# EAGLE design Daughter Board V3_ (EAGLE 9.6.2)
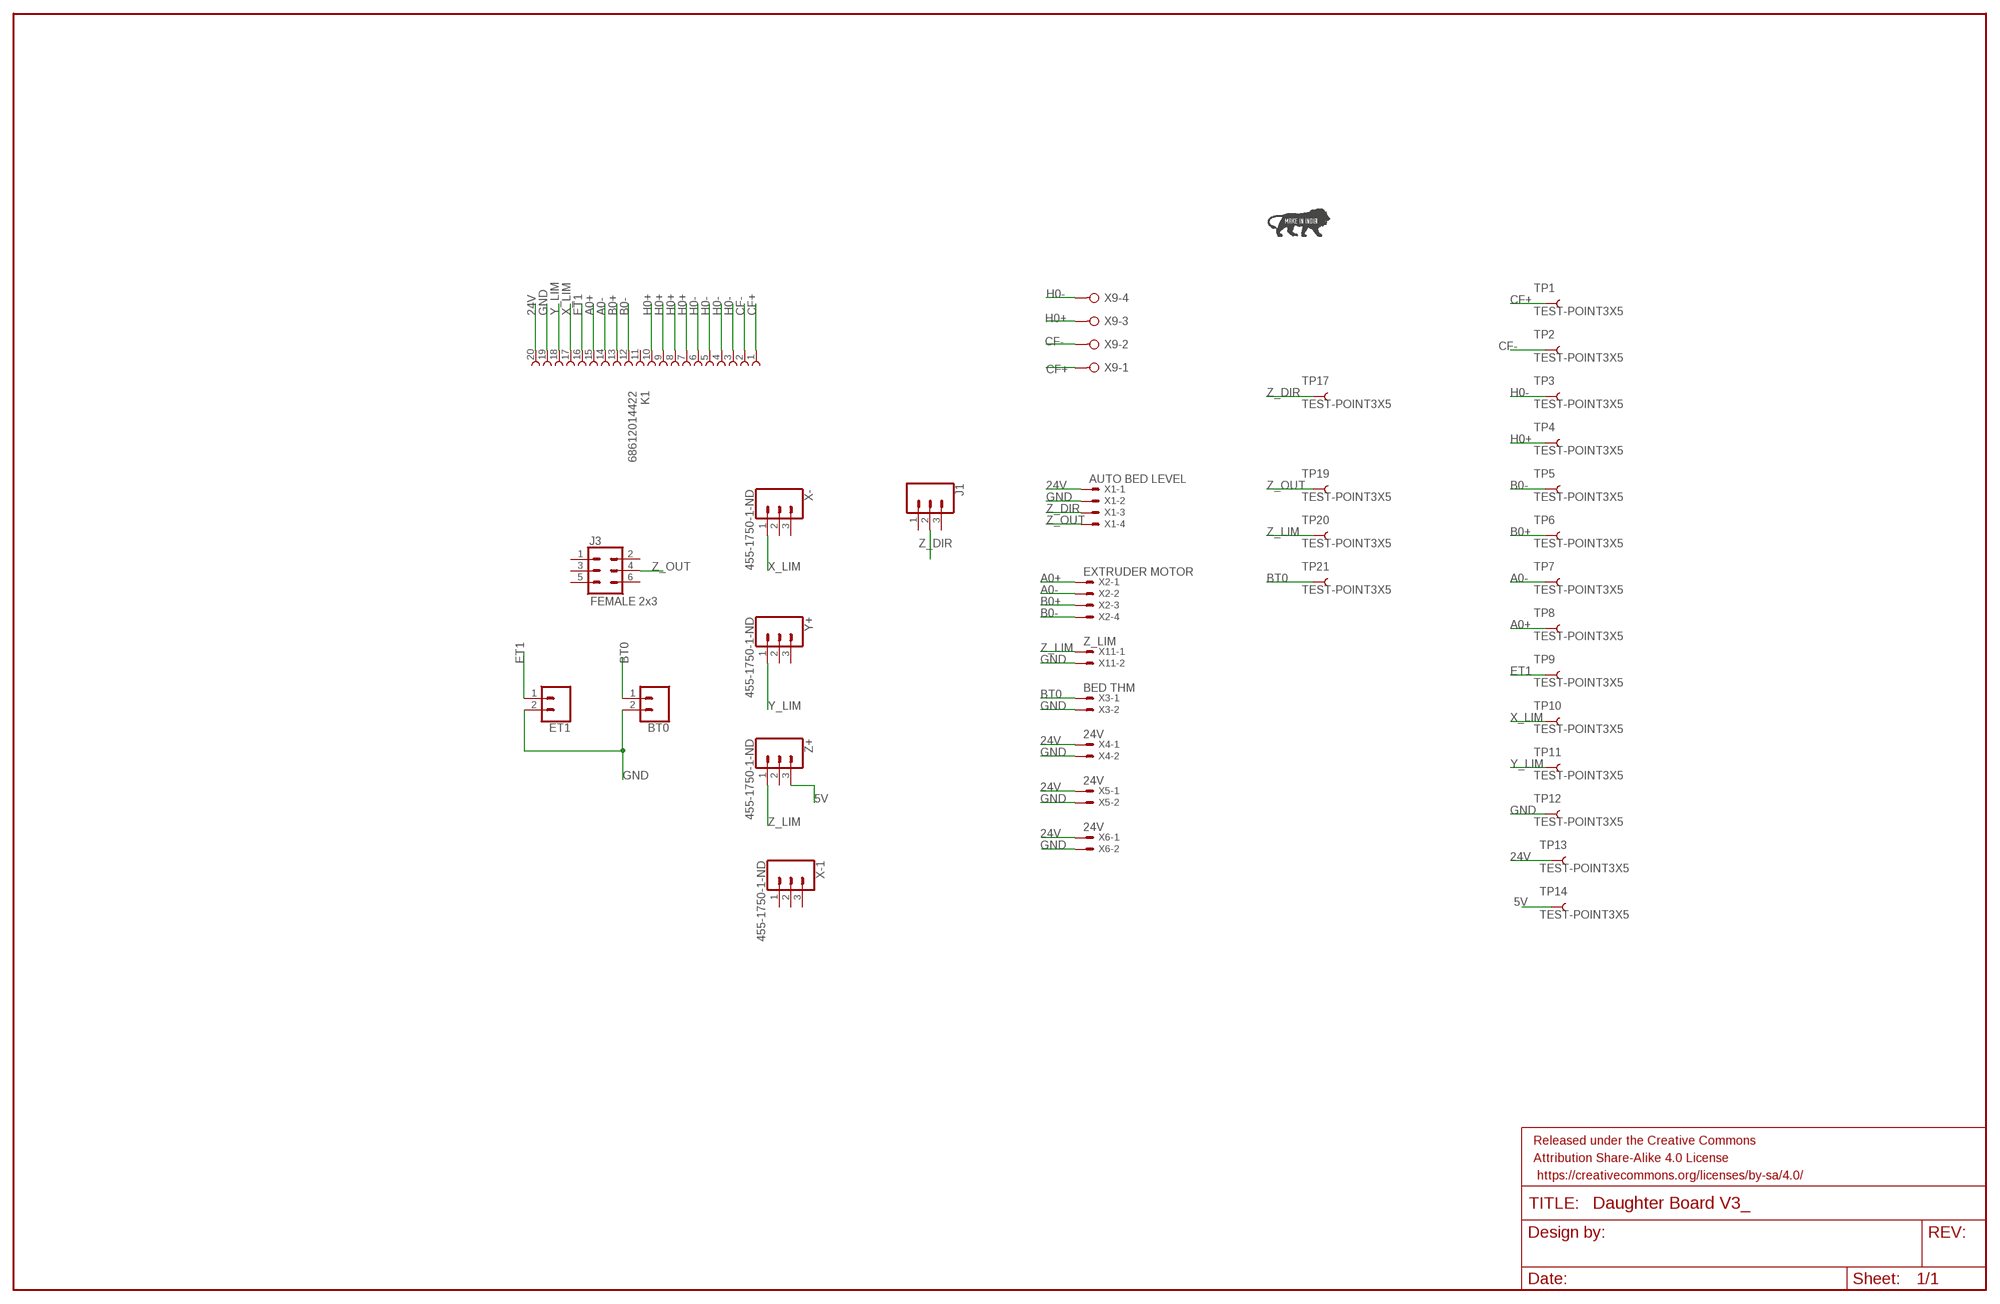
[diagram p0: schematic, sheet 1]

## Parts
BT0  CONN_02  [1X02]
ET1  CONN_02  [1X02]
FRAME1  FRAME-LEDGER  [CREATIVE_COMMONS]
J1  455-1750-1-ND  CONN_03  [1X03]
J3  FEMALE 2x3  CONN_03X2FEMALE  [2X3]
K1  68612014422  [68612014422]
TP1  TEST-POINT3X5  [PAD.03X.05]
TP2  TEST-POINT3X5  [PAD.03X.05]
TP3  TEST-POINT3X5  [PAD.03X.05]
TP4  TEST-POINT3X5  [PAD.03X.05]
TP5  TEST-POINT3X5  [PAD.03X.05]
TP6  TEST-POINT3X5  [PAD.03X.05]
TP7  TEST-POINT3X5  [PAD.03X.05]
TP8  TEST-POINT3X5  [PAD.03X.05]
TP9  TEST-POINT3X5  [PAD.03X.05]
TP10  TEST-POINT3X5  [PAD.03X.05]
TP11  TEST-POINT3X5  [PAD.03X.05]
TP12  TEST-POINT3X5  [PAD.03X.05]
TP13  TEST-POINT3X5  [PAD.03X.05]
TP14  TEST-POINT3X5  [PAD.03X.05]
TP17  TEST-POINT3X5  [PAD.03X.05]
TP19  TEST-POINT3X5  [PAD.03X.05]
TP20  TEST-POINT3X5  [PAD.03X.05]
TP21  TEST-POINT3X5  [PAD.03X.05]
U$2  MAKEININDIA  [MAKEININDIA]
X1  AUTO BED LEVEL  JST-XH-04-PIN-LONG-PAD  [JST-XH-04-PACKAGE-LONG-PAD]
X2  EXTRUDER MOTOR  JST-XH-04-PIN-LONG-PAD  [JST-XH-04-PACKAGE-LONG-PAD]
X3  BED THM  JST-XH-02-PIN-LONG-PAD  [JST-XH-02-PACKAGE-LONG-PAD]
X4  24V  JST-XH-02-PIN-LONG-PAD  [JST-XH-02-PACKAGE-LONG-PAD]
X5  24V  JST-XH-02-PIN-LONG-PAD  [JST-XH-02-PACKAGE-LONG-PAD]
X6  24V  JST-XH-02-PIN-LONG-PAD  [JST-XH-02-PACKAGE-LONG-PAD]
X9  W237-04P  [W237-4P]
X11  Z_LIM  JST-XH-02-PIN-LONG-PAD  [JST-XH-02-PACKAGE-LONG-PAD]
X-  455-1750-1-ND  CONN_03  [1X03]
X-1  455-1750-1-ND  CONN_03  [1X03]
Y+  455-1750-1-ND  CONN_03  [1X03]
Z+  455-1750-1-ND  CONN_03  [1X03]

## Nets
5V: TP14.P$1 Z+.3
24V: K1.20 TP13.P$1 X1.1 X4.1 X5.1 X6.1
A0+: K1.15 TP8.P$1 X2.1
A0-: K1.14 TP7.P$1 X2.2
B0+: K1.13 TP6.P$1 X2.3
B0-: K1.12 TP5.P$1 X2.4
BT0: BT0.1 TP21.P$1 X3.1
CF+: K1.1 TP1.P$1 X9.1
CF-: K1.2 TP2.P$1 X9.2
ET1: ET1.1 K1.16 TP9.P$1
GND: BT0.2 ET1.2 K1.19 TP12.P$1 X1.2 X3.2 X4.2 X5.2 X6.2 X11.2
H0+: K1.7 K1.8 K1.9 K1.10 TP4.P$1 X9.3
H0-: K1.3 K1.4 K1.5 K1.6 TP3.P$1 X9.4
X_LIM: K1.17 TP10.P$1 X-.1
Y_LIM: K1.18 TP11.P$1 Y+.1
Z_DIR: J1.2 TP17.P$1 X1.3
Z_LIM: TP20.P$1 X11.1 Z+.1
Z_OUT: J3.4 TP19.P$1 X1.4
Unconnected: J1.1 J1.3 J3.1 J3.2 J3.3 J3.5 J3.6 K1.11 X-1.1 X-1.2 X-1.3 X-.2 X-.3 Y+.2 Y+.3 Z+.2

## Library data of the parts
BT0 ET1 = SparkFun-Connectors:CONN_02: Multi connection point. Often used as Generic Header-pin footprint for 0.1 inch spaced/style header connections On any of the 0.1 inch spaced packages, you can populate with these: Break Away Headers - Straight <https://www.sparkfun.com/products/116> (PRT-00116) Break Away Male Headers - Right Angle <https://www.sparkfun.com/products/553> (PRT-00553) Female Headers <https://www.sparkfun.com/products/115> (PRT-00115) Break Away Headers - Machine Pin <https://www.sparkfun.com/products/117> (PRT-00117) Break Away Female Headers - Swiss Machine Pin <https://www.sparkfun.com/products/743> (PRT-00743) For SCREWTERMINALS and SPRING TERMINALS visit here: Screw Terimnals on SparkFun.com <https://www.sparkfun.com/search/results?term=Screw+Terminals> (5mm/3.5mm/2.54mm spacing) This device is also useful as a general connection point to wire up your design to another part of your project. Our various solder wires solder well into these plated through hole pads. Hook-Up Wire - Assortment (Stranded, 22 AWG) <https://www.sparkfun.com/products/11375> (PRT-11375) Hook-Up Wire - Assortment (Solid Core, 22 AWG) <https://www.sparkfun.com/products/11367> (PRT-11367) View the entire wire category on our website here <https://www.sparkfun.com/categories/141> Special notes: Molex polarized connector foot print use with: PRT-08233 with associated crimp pins and housings. 2.54_SCREWTERM for use with PRT-10571. 3.5mm Screw Terminal footprints for PRT-08084 5mm Screw Terminal footprints for use with PRT-08432
FRAME1 = SparkFun-Aesthetics:FRAME-LEDGER: Schematic Frame - Ledger Standard 11x14 US Ledger frame
J1 X- X-1 Y+ Z+ = SparkFun-Connectors:CONN_03: Multi connection point. Often used as Generic Header-pin footprint for 0.1 inch spaced/style header connections On any of the 0.1 inch spaced packages, you can populate with these: Break Away Headers - Straight <https://www.sparkfun.com/products/116> (PRT-00116) Break Away Male Headers - Right Angle <https://www.sparkfun.com/products/553> (PRT-00553) Female Headers <https://www.sparkfun.com/products/115> (PRT-00115) Break Away Headers - Machine Pin <https://www.sparkfun.com/products/117> (PRT-00117) Break Away Female Headers - Swiss Machine Pin <https://www.sparkfun.com/products/743> (PRT-00743) Stackable Header - 3 Pin (Female, 0.1") <https://www.sparkfun.com/products/13875> (PRT-13875) For SCREWTERMINALS and SPRING TERMINALS visit here: Screw Terimnals on SparkFun.com <https://www.sparkfun.com/search/results?term=Screw+Terminals> (5mm/3.5mm/2.54mm spacing) This device is also useful as a general connection point to wire up your design to another part of your project. Our various solder wires solder well into these plated through hole pads. Hook-Up Wire - Assortment (Stranded, 22 AWG) <https://www.sparkfun.com/products/11375> (PRT-11375) Hook-Up Wire - Assortment (Solid Core, 22 AWG) <https://www.sparkfun.com/products/11367> (PRT-11367) View the entire wire category on our website here <https://www.sparkfun.com/categories/141> Special notes: Molex polarized connector foot print use with SKU : PRT-08232 with associated crimp pins and housings.; PROD_ID: XXX-00000
J3 = SparkFun-Connectors:CONN_03X2: Multi connection point. Often used as Generic Header-pin footprint for 0.1 inch spaced/style header connections You can populate with any combo of single row headers, but if you'd like an exact match, check these: Header - 2x3 (Male, 0.1") <https://www.sparkfun.com/products/12807> (PRT-12807) Header - 2x3 (Female, 0.1") <https://www.sparkfun.com/products/13010> (PRT-13010) 2x3 Pin Shrouded Header <https://www.sparkfun.com/products/10877> (PRT-10877) On any of the 0.1 inch spaced packages, you can populate with these: Break Away Headers - Straight <https://www.sparkfun.com/products/116> (PRT-00116) Break Away Male Headers - Right Angle <https://www.sparkfun.com/products/553> (PRT-00553) Female Headers <https://www.sparkfun.com/products/115> (PRT-00115) Break Away Headers - Machine Pin <https://www.sparkfun.com/products/117> (PRT-00117) Break Away Female Headers - Swiss Machine Pin <https://www.sparkfun.com/products/743> (PRT-00743) Special note: the shrouded connector mates well with our 3x2 ribbon cables: Ribbon Crimp Connector - 6-pin (2x3, Female) <https://www.sparkfun.com/products/10651> (PRT-10651) Ribbon Cable - 6 wire (15ft) <https://www.sparkfun.com/products/10646> (PRT-10646); PROD_ID: CONN-11566
K1 = Wurth_Elektronik_Electromechanic_FPC_Connectors_&_Flat_Flexible_Cable_rev15b:68612014422: WR-FPC 1.00mm SMT ZIF Horizontal Bottom Contact, 20 Pins=>Code : Con_FPC_ZIF_1.00_68612014422 <http://katalog.we-online.de/media/images/eican/Con_FPC_ZIF_1.00_6861xx14422_pf2.jpg> Details see: http://katalog.we-online.de/en/em/686_1xx_144_22 Created 2014-07-09, Karrer Zheng 2014 (C) Würth Elektronik
TP1-TP14 TP17 TP19-TP21 = SparkFun-Connectors:TEST-POINT: SparkFun Test Points Bare copper test points for troubleshooting or In-Circuit-Testing. These are used by our Production team for verifying production board runs using pogo-pins on test beds. SparkFun Products: SparkFun LSM9DS1 Breakout <https://www.sparkfun.com/products/13284> SparkFun PSOC <https://www.sparkfun.com/products/13714> SparkFun Load Cell Amplifier <https://www.sparkfun.com/products/13879>
U$2 = FracktalWorks_Eagle_Library:MAKEININDIA
X1 X2 = Rembrandt Electronics - JST XH Connectors v1-0:JST-XH-04-PIN: JST XH Connector 2 Pin Wire to board connector. Pitch: 2,54 mm, (0.100") Number of pins: 4 Created by Rembrandt Electronics www.rembrandtelectronics.com
X3-X6 X11 = Rembrandt Electronics - JST XH Connectors v1-0:JST-XH-02-PIN: JST XH Connector 2 Pin Wire to board connector. Pitch: 2,54 mm, (0.100") Number of pins: 2 Created by Rembrandt Electronics www.rembrandtelectronics.com
X9 = con-wago-508:W237-04P: WAGO SREW CLAMP; OC_FARNELL: unknown; OC_NEWARK: unknown

## Net classes
0 default: width 0.406 mm

## Board
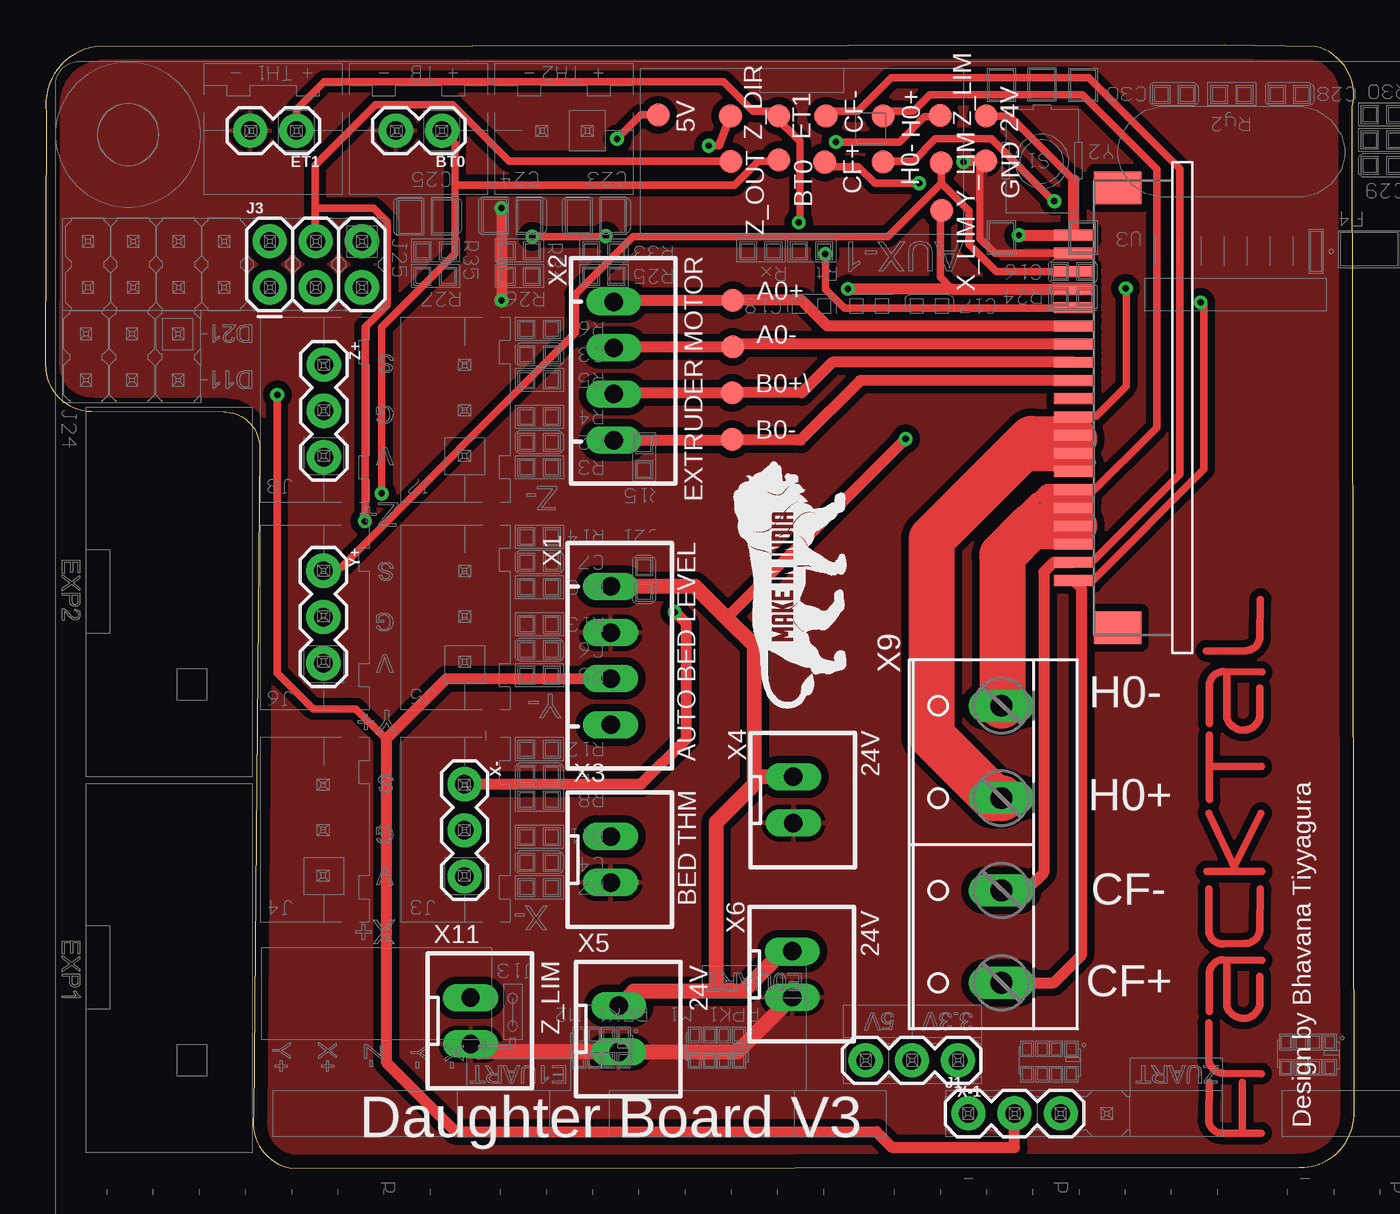
[diagram p1: board, top side]
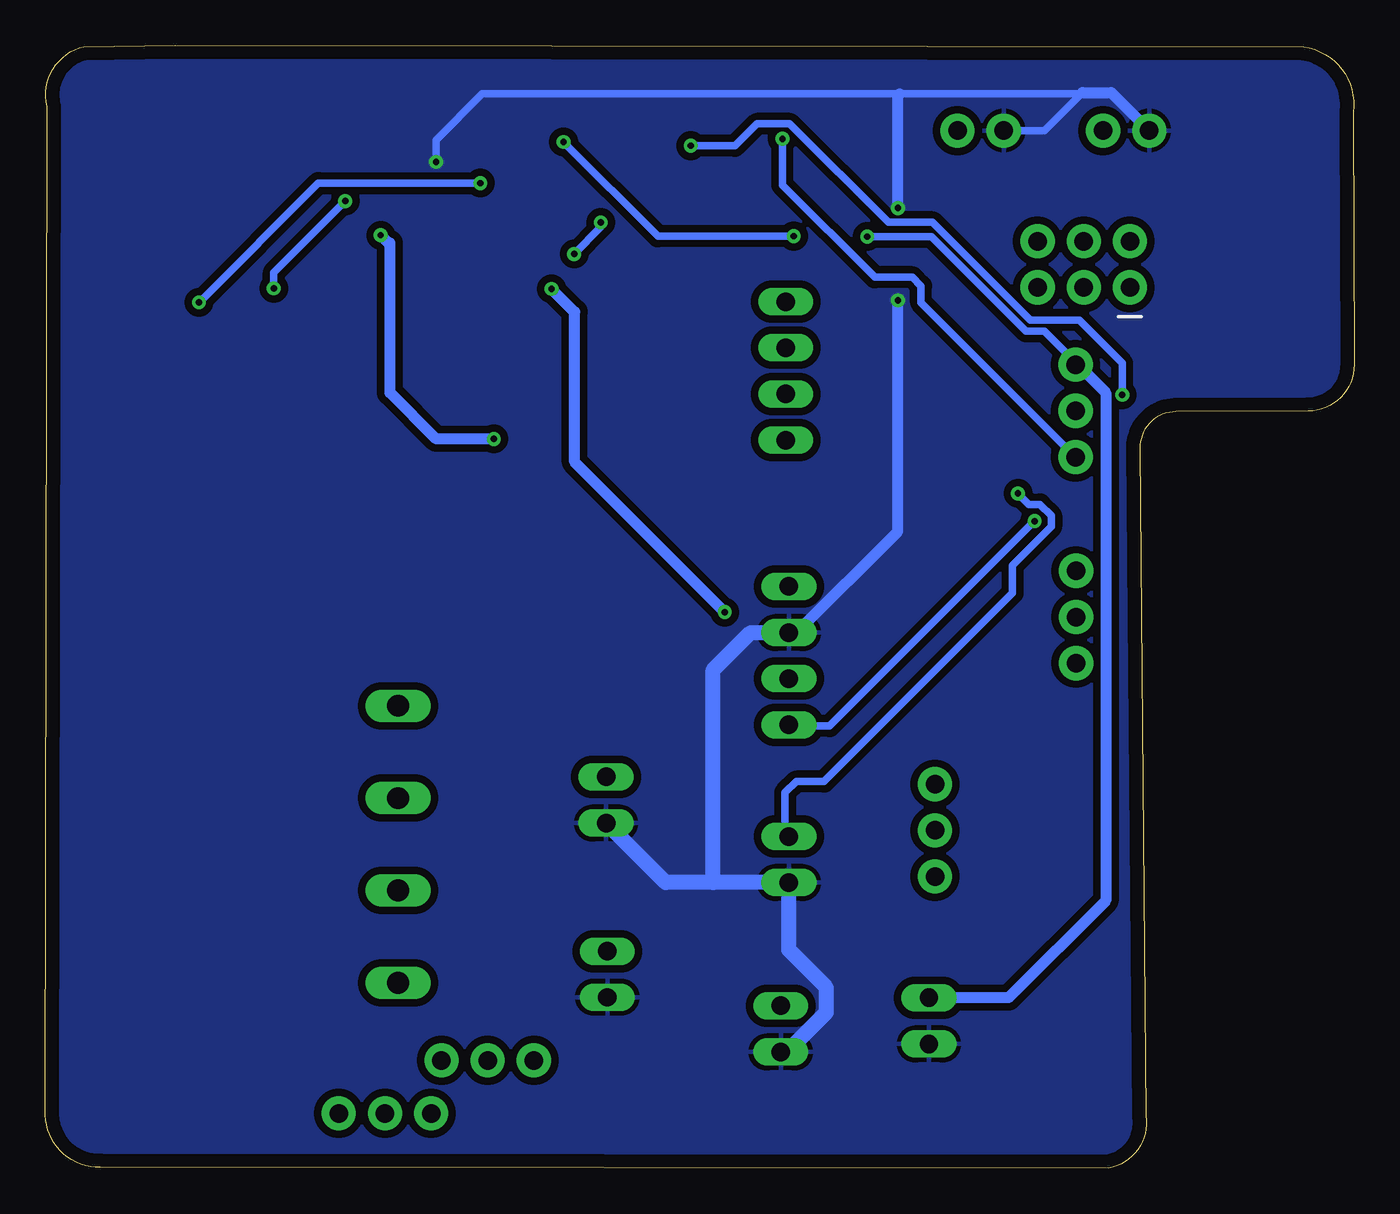
[diagram p2: board, bottom side, seen from below]

Size 71.98 x 61.76 mm. Coordinates in mm from the lower left corner, seen from the top.
Outline: 64.85,61.76 2.77,61.68 arc89 0.04,58.1 0,44.19 arc90 2.53,41.64 9.8,41.61 arc-90 11.79,39.59 11.45,2.88 arc90 13.53,0 68.96,0.06 arc91 71.98,2.91 71.89,58.4 arc90 69.86,61.7 64.85,61.76
Copper layers (1*16): Top 0.035mm / dielectric 1.5mm / Bottom 0.035mm
Design rules "LionCircuits": minimum track width 8mil, minimum drill 0.35mm, track to track 8mil, track to pad 8mil, pad to pad 8mil, via to via 8mil, smd to smd 8mil, copper to edge 30mil, drill to drill 10mil, minimum pad ring 10mil, minimum via ring 8mil, stop-mask expansion 4mil, vias tented up to drill 0mil, thermal gap 10mil

### Footprints (pad centres in the part's own frame; a part is rotated, then mirrored left to right if it is on the bottom)
1X02 = drill 1.016 pad 1.88: 1 0,0; 2 2.54,0
1X03 = drill 1.016 pad 1.88: 1 0,0; 2 2.54,0; 3 5.08,0
2X3 = drill 1.016 pad 1.88: 1 0,0; 2 0,2.54; 3 2.54,0; 4 2.54,2.54; 5 5.08,0; 6 5.08,2.54
68612014422 = smd 0.6 x 2.2: 1 -15.77,1.1; 2 -14.77,1.1; 3 -13.77,1.1; 4 -12.77,1.1; 5 -11.77,1.1; 6 -10.77,1.1; 7 -9.77,1.1; 8 -8.77,1.1; 9 -7.77,1.1; 10 -6.77,1.1; 11 -5.77,1.1; 12 -4.77,1.1; 13 -3.77,1.1; 14 -2.77,1.1; 15 -1.77,1.1; 16 -0.77,1.1; 17 0.23,1.1; 18 1.23,1.1; 19 2.23,1.1; 20 3.23,1.1 | smd 1.8 x 2.6: Z1 -18.37,-1.3; Z2 5.83,-1.3
PAD.03X.05 = smd 1.27 x 1.27: P$1 0,0
JST-XH-04-PACKAGE-LONG-PAD = drill 1.016 long: 1 -3.81,0; 2 -1.27,0; 3 1.27,0; 4 3.81,0
JST-XH-02-PACKAGE-LONG-PAD = drill 1.016 long: 1 -1.27,0; 2 1.27,0
W237-4P = drill 1.194 long: 1 -7.62,-0.635; 2 -2.54,-0.635; 3 2.54,-0.635; 4 7.62,-0.635

### Placement (x,y rotation side)
BT0  21.81,57.07 180 top
ET1  13.81,57.07 180 top
FRAME1  28.18,-32.47 0 top  (outside the outline)
J1  50.77,3.01 0 top
J3  12.33,48.44 0 top
K1  57.68,48.09 90 top
TP1  42.87,55.34 0 top
TP2  42.93,57.89 0 top
TP3  46.08,57.88 0 top
TP4  46.09,55.34 0 top
TP5  37.77,40.09 0 top
TP6  37.78,42.65 0 top
TP7  37.8,45.18 0 top
TP8  37.8,47.74 0 top
TP9  40.33,57.87 0 top
TP10  49.29,52.69 90 top
TP11  49.26,55.3 0 top
TP12  51.71,55.41 0 top
TP13  51.75,57.87 0 top
TP14  33.7,57.93 0 top
TP17  37.68,57.88 0 top
TP19  37.7,55.38 0 top
TP20  49.23,57.91 0 top
TP21  40.34,55.45 0 top
U$1  [FRACKTALLOGO]  66.98,13.91 90 top
U$2  44.74,26.27 90 top
X1  31.08,28.19 270 top
X2  31.26,43.85 270 top
X3  31.08,16.97 270 top
X4  41.14,20.25 270 top
X5  31.54,7.66 270 top
X6  41.07,10.66 270 top
X9  51.95,17.82 90 top
X11  23.38,8.1 270 top
X-  23.05,21.12 270 top
X-1  50.2,5.93 180 top
Y+  15.29,32.85 270 top
Z+  15.32,44.19 270 top

### Tracks (layer width: path | path; a pad name or v marks a point on that pad's centre or on a via)
5V  (via drill 0.35)
  Top 0.406: v31.44,56.62 32.76,57.94 TP14.P$1
  Bottom 0.406: Z+.3 23.82,47.62 23.82,48.53 24.29,49 26.36,49 31.44,54.08 v31.44,56.62
24V  (via drill 0.35)
  Top 0.406: 56.58,54.35 53.05,57.87 TP13.P$1 | 36.89,9.79 36.94,9.74
  Top 0.61: K1.20 56.58,54.35 | 37.47,30.27 v47.32,40.11 | 56.53,51.37 K1.20 | v53.54,51.32 K1.20
  Top 0.813: X5.1 32.35,9.74 36.94,9.74 38.36,9.74 40.56,11.93 X6.1 | X4.1 38.99,21.52 | 36.89,9.79 36.89,19.02 38.99,21.13 38.99,21.52 | 38.99,21.52 38.99,28.75 37.47,30.27 35.74,32 X1.1
  Bottom 0.61: v47.32,40.11 50.49,40.11 53.03,42.65 53.03,50.91 53.13,50.91 v53.54,51.32
A0+
  Top 0.61: K1.15 43.01,46.32 41.59,47.74 TP8.P$1 31.33,47.74 X2.1
A0-
  Top 0.61: K1.14 37.94,45.32 | X2.2 31.31,45.18 TP7.P$1
  Top 0.813: 37.94,45.32 TP7.P$1
B0+
  Top 0.61: K1.13 43.28,44.32 41.6,42.65 TP6.P$1 31.33,42.65 X2.3
B0-
  Top 0.61: 37.72,40.04 TP5.P$1 | K1.12 44.82,43.32 41.53,40.04 37.72,40.04 | X2.4 37.72,40.04
BT0  (via drill 0.35)
  Top 0.406: 22.54,54.08 37.89,54.08 39.21,55.4 40.13,55.4 TP21.P$1 | v18.49,37.11 18.49,46.26 22.54,50.31 22.54,54.08 | 22.54,54.08 22.54,56.34 BT0.1
  Bottom 0.406: v18.49,37.11 17.88,36.5 17.27,36.5 16.66,35.89 16.66,35.28 18.79,33.15 18.79,31.63 29.16,21.26 30.68,21.26 31.29,20.65 31.29,18.52 X3.1
CF+  (via drill 0.35)
  Top 0.406: v48.05,54.18 45.61,54.18 44.7,55.1 43.18,55.1 TP1.P$1 | v63.54,47.62 63.72,47.44 63.72,38.45 57.57,32.31 56.59,32.31 K1.1
  Top 0.61: X9.1 55.48,10.2 56.98,11.69 56.98,31.92 K1.1
  Bottom 0.406: v48.05,54.18 56.98,54.18 v63.54,47.62
CF-
  Top 0.406: K1.2 57.55,33.33 62.4,38.17 62.4,54.98 57.4,59.97 46.53,59.97 44.7,58.14 43.18,58.14 TP2.P$1
  Top 0.61: X9.2 53.94,15.28 54.91,16.25 54.91,32.78 55.45,33.32 56.08,33.32 56.09,33.32 K1.2
ET1  (via drill 0.35)
  Top 0.406: K1.16 56.56,47.31 43.95,47.31 42.9,48.36 v42.9,50.28 | ET1.1 13.81,58.24 15.33,59.77 37.28,59.77 38.91,58.14 40.13,58.14 TP9.P$1 40.13,57.84 41.49,56.48 41.49,52.08 v41.43,52.02
  Bottom 0.406: v42.9,50.28 41.43,51.75 v41.43,52.02
GND  (via drill 0.35)
  Top 0.406: K1.19 52.22,50.32 51.41,51.13 51.41,55.4 TP12.P$1
  Top 0.61: v25.09,52.81 v25.09,47.73 | TP12.P$1 50.55,55.41 v50.49,55.35
  Top 0.813: X11.2 23.83,6.39 X5.2 38.07,6.39 X6.2
  Bottom 0.406: BT0.2 17.03,57.07 15.01,59.09 | 15.01,59.09 14.94,59.16 | 15.01,59.09 24.99,59.09 47.95,59.09 50.49,56.55 v50.49,55.35
  Bottom 0.61: X1.2 30.66,29.46 25.09,35.03 v25.09,47.73 | v25.09,52.81 25.09,58.99 24.99,59.09 | 14.94,59.16 13.35,59.16 ET1.2
  Bottom 0.813: 35.25,15.71 X3.2 31.08,12 29.03,9.94 29.03,8.57 31.21,6.39 X5.2 | 35.25,15.71 37.87,15.71 X4.2 | 35.25,15.71 35.25,27.41 33.2,29.46 X1.2
  pour Top (isolate 0.406): 69.78,61.74 arc-90 72.03,59.48 72.03,3.08 arc-90 68.97,0.01 13.87,0.01 arc-90 11.44,2.44 11.44,40.12 arc90 9.93,41.63 2.08,41.63 arc-90 0.02,43.7 0.02,58.7 arc-90 3.03,61.71 3.29,61.71
  pour Bottom (isolate 0.406): 2.85,61.73 arc90 2.89,61.69 69.71,61.69 arc-90 71.97,59.43 71.97,2.58 arc-90 69.75,0.36 13.94,0.36 arc-90 11.75,2.54 11.75,39.99 arc90 10.06,41.69 2.1,41.69 arc-90 -0.03,43.82 -0.03,58.68 -0.03,58.79 arc-90
H0+  (via drill 0.35)
  Top 0.406: v59.42,48.39 59.45,48.36 59.45,43.03 57.81,41.38 56.59,41.38 K1.10 | TP4.P$1 46.22,55.4 47.75,55.4 48.96,56.62 52.02,56.62 55.44,53.2 v55.49,53.2 | K1.8 K1.7 56.19,38.71 55.55,38.71 55.55,38.79 55.59,38.82 56.76,38.82 | 57.53,38.82 56.95,38.82
  Top 0.508: 57.53,38.82 57.04,38.32 K1.7 | 56.95,38.82 56.76,38.82 | 56.76,38.82 53.92,38.82 53.66,38.56 56.5,38.56 56.76,38.82
  Top 0.61: K1.10 K1.9 56.58,40.11 K1.8
  Top 2.54: X9.3 52.14,20.36 48.74,23.76 48.74,34.62 54.23,40.11 56.58,40.11
  Bottom 0.406: v55.49,53.2 59.42,49.27 v59.42,48.39
H0-
  Top 0.406: TP3.P$1 46.35,58.14 47.75,58.14 48.66,59.06 57.03,59.06 61.13,54.95 61.13,40.75 57.31,36.93 56.99,36.6 56.58,36.6 | K1.3 56.84,34.4 K1.4 | 55.53,35.14 54.71,35.14
  Top 0.508: K1.5 56.58,36.6 K1.6 56.11,36.86 56.04,36.86 | 55.11,35.14 54.71,35.14 54.19,35.14 53.44,35.89 54.41,36.86 54.57,36.86 54.83,36.86
  Top 0.61: 56.21,35.32 56.21,35.96 K1.5 56.04,36.86 55.61,36.86 54.83,36.86 | K1.6 55.03,37.32 54.57,36.86
  Top 0.813: 55.61,36.86 57.24,36.86 57.31,36.93
  Top 2.54: X9.4 52.62,25.48 52.62,33.7 54.24,35.32 56.21,35.32 K1.4
X_LIM  (via drill 0.35)
  Top 0.406: 49.86,48.37 49.22,49 49.22,52.62
  Top 0.61: K1.17 49.9,48.32 49.86,48.37 v44.14,48.37 | 49.22,52.62 TP10.P$1 | v34.62,30.59 35.25,29.95 35.25,23.6 32.77,21.12 X-.1
  Bottom 0.61: v34.62,30.59 42.87,38.84 42.87,47.1 v44.14,48.37
Y_LIM
  Top 0.406: 49.27,54.18 49.27,55.1 TP11.P$1 | 49.27,54.18 50.8,52.66 50.8,50.83 52.31,49.31 K1.18 | 49.27,54.18 46.33,51.24 32.31,51.24 29.16,48.09 29.16,45.95 16.25,33.05 Y+.1
Z_DIR  (via drill 0.35)
  Top 0.406: 18.74,23.6 17.07,25.27 14.73,25.27 12.75,27.24 v12.75,42.53 v12.75,42.54 | TP17.P$1 37.05,56.24 v36.48,56.24
  Top 0.61: X1.3 22.06,26.92 18.74,23.6 18.74,5.82 22.55,2.01 45.71,2.01 46.6,1.13 53.31,1.13 J1.2
  Bottom 0.406: v12.75,42.54 12.75,44.28 15.11,46.64 17.8,46.64 23.18,52.03 25.62,52.03 31.05,57.45 32.84,57.45 34.05,56.23 v36.49,56.23 v36.48,56.24
Z_LIM  (via drill 0.35)
  Top 0.406: TP20.P$1 48.97,57.84 48.36,57.84 46.97,56.45 v43.48,56.45 | v26.77,51.24 30.6,51.24 30.7,51.14 v30.82,51.27
  Bottom 0.406: v30.82,51.27 38.3,51.27 v43.48,56.45 | 15.2,44.19 17.04,46.03 18.05,46.03 23.26,51.24 v26.77,51.24
  Bottom 0.61: Z+.1 15.2,44.19 13.66,42.65 13.66,14.71 19,9.37 X11.1
Z_OUT  (via drill 0.35)
  Top 0.406: 14.83,52.82 14.83,51.07 J3.4 | 14.83,52.82 14.83,55.18 18.16,58.5 22.4,58.5 25.5,55.4 37.69,55.4 TP19.P$1 | v17.57,35.59 17.57,46.26 18.79,47.48 18.79,52.07 18.04,52.82 14.83,52.82
  Bottom 0.406: v17.57,35.59 28.85,24.31 30.98,24.31 X1.4

### Text on the board
tNames: Z_LIM | Z_DIR | ET1 | CF- | H0+ | 24V | 5V | Y_LIM | Z_OUT | CF+ | H0- | GND | BT0 | X_LIM | A0+ | A0- | B0+\ | B0- | H0- | H0+ | CF- | CF+ | Design by Bhavana Tiyyagura | Daughter Board V3